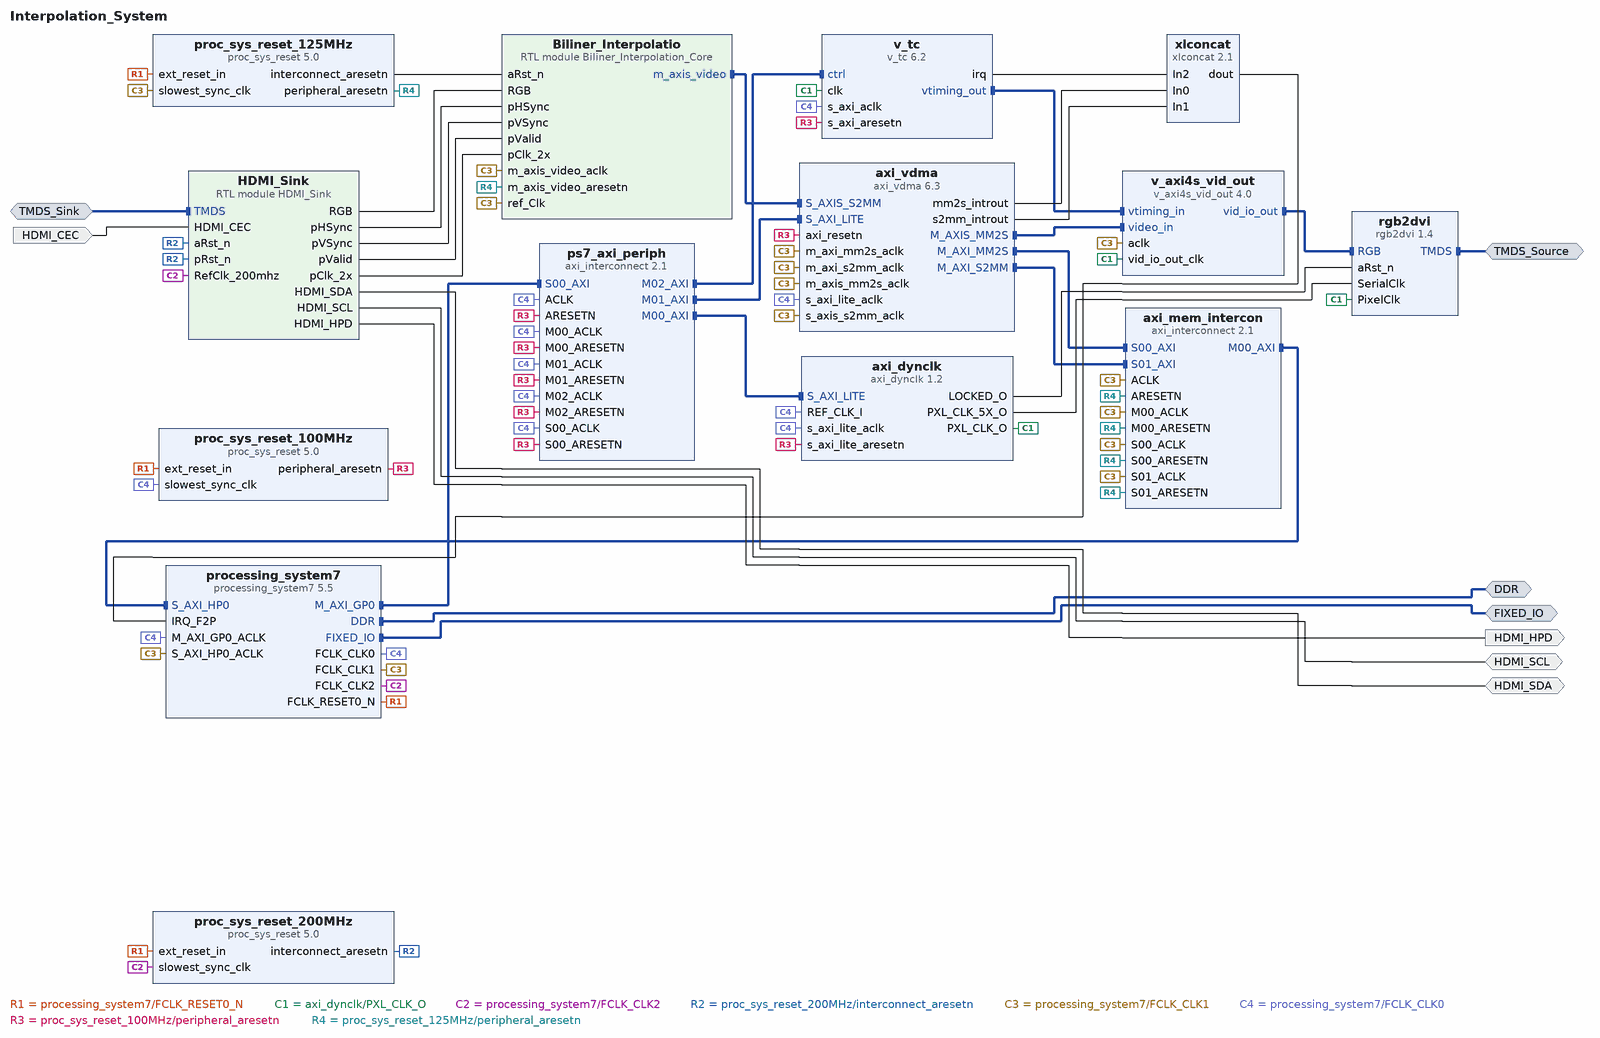
[diagram p0: block diagram of the top level]
# Vivado block design Interpolation_System, xc7z020clg400-1, Vivado 2019.2
create_bd_design Interpolation_System

create_bd_intf_port -mode Master -vlnv xilinx.com:interface:ddrx_rtl:1.0 DDR
create_bd_intf_port -mode Master -vlnv xilinx.com:display_processing_system7:fixedio_rtl:1.0 FIXED_IO
create_bd_intf_port -mode Master -vlnv digilentinc.com:interface:tmds_rtl:1.0 TMDS_Source
create_bd_intf_port -mode Slave -vlnv digilentinc.com:interface:tmds_rtl:1.0 TMDS_Sink
create_bd_port -dir IO HDMI_SDA
create_bd_port -dir IO HDMI_SCL
create_bd_port -dir O HDMI_HPD
create_bd_port -dir I HDMI_CEC

create_bd_cell -type ip -vlnv xilinx.com:ip:processing_system7:5.5 processing_system7
set_property -dict [list \
  CONFIG.PCW_APU_PERIPHERAL_FREQMHZ 650 \
  CONFIG.PCW_CRYSTAL_PERIPHERAL_FREQMHZ 50 \
  CONFIG.PCW_ENET0_ENET0_IO {MIO 16 .. 27} \
  CONFIG.PCW_ENET0_GRP_MDIO_ENABLE 1 \
  CONFIG.PCW_ENET0_GRP_MDIO_IO {MIO 52 .. 53} \
  CONFIG.PCW_ENET0_PERIPHERAL_ENABLE 1 \
  CONFIG.PCW_ENET0_RESET_ENABLE 1 \
  CONFIG.PCW_ENET0_RESET_IO {MIO 9} \
  CONFIG.PCW_ENET_RESET_ENABLE 1 \
  CONFIG.PCW_ENET_RESET_SELECT {Share reset pin} \
  CONFIG.PCW_EN_CLK1_PORT 1 \
  CONFIG.PCW_EN_CLK2_PORT 1 \
  CONFIG.PCW_FPGA0_PERIPHERAL_FREQMHZ 100 \
  CONFIG.PCW_FPGA1_PERIPHERAL_FREQMHZ 125 \
  CONFIG.PCW_FPGA2_PERIPHERAL_FREQMHZ 200 \
  CONFIG.PCW_FPGA_FCLK1_ENABLE 1 \
  CONFIG.PCW_FPGA_FCLK2_ENABLE 1 \
  CONFIG.PCW_GPIO_MIO_GPIO_ENABLE 1 \
  CONFIG.PCW_GPIO_MIO_GPIO_IO MIO \
  CONFIG.PCW_I2C_RESET_ENABLE 1 \
  CONFIG.PCW_IRQ_F2P_INTR 1 \
  CONFIG.PCW_PERIPHERAL_BOARD_PRESET None \
  CONFIG.PCW_PRESET_BANK1_VOLTAGE {LVCMOS 1.8V} \
  CONFIG.PCW_QSPI_GRP_FBCLK_ENABLE 1 \
  CONFIG.PCW_QSPI_GRP_FBCLK_IO {MIO 8} \
  CONFIG.PCW_QSPI_GRP_SINGLE_SS_ENABLE 1 \
  CONFIG.PCW_QSPI_GRP_SINGLE_SS_IO {MIO 1 .. 6} \
  CONFIG.PCW_QSPI_PERIPHERAL_ENABLE 1 \
  CONFIG.PCW_QSPI_QSPI_IO {MIO 1 .. 6} \
  CONFIG.PCW_SD0_PERIPHERAL_ENABLE 0 \
  CONFIG.PCW_SDIO_PERIPHERAL_FREQMHZ 50 \
  CONFIG.PCW_SINGLE_QSPI_DATA_MODE x4 \
  CONFIG.PCW_UART0_PERIPHERAL_ENABLE 1 \
  CONFIG.PCW_UART0_UART0_IO {MIO 14 .. 15} \
  CONFIG.PCW_UART1_PERIPHERAL_ENABLE 0 \
  CONFIG.PCW_UART_PERIPHERAL_FREQMHZ 100 \
  CONFIG.PCW_UIPARAM_DDR_BUS_WIDTH {16 Bit} \
  CONFIG.PCW_UIPARAM_DDR_FREQ_MHZ 525 \
  CONFIG.PCW_UIPARAM_DDR_PARTNO {MT41J256M16 RE-125} \
  CONFIG.PCW_USB0_PERIPHERAL_ENABLE 0 \
  CONFIG.PCW_USB0_RESET_ENABLE 1 \
  CONFIG.PCW_USB0_RESET_IO {MIO 46} \
  CONFIG.PCW_USB_RESET_ENABLE 1 \
  CONFIG.PCW_USE_FABRIC_INTERRUPT 1 \
  CONFIG.PCW_USE_S_AXI_HP0 1 \
] [get_bd_cells processing_system7]
# 494 more settings of processing_system7 are not shown: defaults, MIO pin electricals, DDR timing, and values the tool derives
create_bd_cell -type ip -vlnv xilinx.com:ip:axi_vdma:6.3 axi_vdma
set_property -dict [list \
  CONFIG.c_include_mm2s_dre 1 \
  CONFIG.c_include_s2mm_dre 1 \
  CONFIG.c_m_axi_s2mm_data_width 64 \
  CONFIG.c_m_axis_mm2s_tdata_width 24 \
  CONFIG.c_mm2s_genlock_mode 0 \
  CONFIG.c_mm2s_linebuffer_depth 2048 \
  CONFIG.c_mm2s_max_burst_length 128 \
  CONFIG.c_num_fstores 4 \
  CONFIG.c_s2mm_genlock_mode 1 \
  CONFIG.c_s2mm_linebuffer_depth 2048 \
  CONFIG.c_s2mm_max_burst_length 128 \
] [get_bd_cells axi_vdma]
create_bd_cell -type ip -vlnv xilinx.com:ip:proc_sys_reset:5.0 proc_sys_reset_100MHz
create_bd_cell -type ip -vlnv xilinx.com:ip:proc_sys_reset:5.0 proc_sys_reset_125MHz
create_bd_cell -type ip -vlnv xilinx.com:ip:v_tc:6.2 v_tc
set_property -dict {CONFIG.enable_detection false} [get_bd_cells v_tc]
create_bd_cell -type ip -vlnv xilinx.com:ip:v_axi4s_vid_out:4.0 v_axi4s_vid_out
set_property -dict {CONFIG.C_ADDR_WIDTH 12 CONFIG.C_HAS_ASYNC_CLK 1 CONFIG.C_VTG_MASTER_SLAVE 1} [get_bd_cells v_axi4s_vid_out]
create_bd_cell -type ip -vlnv xilinx.com:ip:xlconcat:2.1 xlconcat
set_property -dict {CONFIG.NUM_PORTS 3} [get_bd_cells xlconcat]
create_bd_cell -type ip -vlnv digilentinc.com:ip:axi_dynclk:1.2 axi_dynclk
create_bd_cell -type ip -vlnv digilentinc.com:ip:rgb2dvi:1.4 rgb2dvi
set_property -dict {CONFIG.kGenerateSerialClk false CONFIG.kRstActiveHigh false} [get_bd_cells rgb2dvi]
create_bd_cell -type ip -vlnv xilinx.com:ip:proc_sys_reset:5.0 proc_sys_reset_200MHz
create_bd_cell -type ip -vlnv xilinx.com:ip:axi_interconnect:2.1 ps7_axi_periph
set_property -dict {CONFIG.NUM_MI 3} [get_bd_cells ps7_axi_periph]
create_bd_cell -type ip -vlnv xilinx.com:ip:axi_interconnect:2.1 axi_mem_intercon
set_property -dict {CONFIG.NUM_MI 1 CONFIG.NUM_SI 2} [get_bd_cells axi_mem_intercon]
create_bd_cell -type module -reference HDMI_Sink HDMI_Sink
create_bd_cell -type module -reference Biliner_Interpolation_Core Biliner_Interpolatio

# ---- connections ----

connect_bd_intf_net [get_bd_intf_pins axi_vdma/M_AXIS_MM2S] [get_bd_intf_pins v_axi4s_vid_out/video_in]
connect_bd_intf_net [get_bd_intf_pins ps7_axi_periph/M01_AXI] [get_bd_intf_pins axi_vdma/S_AXI_LITE]
connect_bd_intf_net [get_bd_intf_pins rgb2dvi/RGB] [get_bd_intf_pins v_axi4s_vid_out/vid_io_out]
connect_bd_intf_net [get_bd_intf_pins processing_system7/M_AXI_GP0] [get_bd_intf_pins ps7_axi_periph/S00_AXI]
connect_bd_intf_net [get_bd_intf_pins ps7_axi_periph/M00_AXI] [get_bd_intf_pins axi_dynclk/S_AXI_LITE]
connect_bd_intf_net [get_bd_intf_ports DDR] [get_bd_intf_pins processing_system7/DDR]
connect_bd_intf_net [get_bd_intf_pins v_tc/vtiming_out] [get_bd_intf_pins v_axi4s_vid_out/vtiming_in]
connect_bd_intf_net -intf_net Biliner_Interpolatio_0_m_axis_video [get_bd_intf_pins Biliner_Interpolatio/m_axis_video] [get_bd_intf_pins axi_vdma/S_AXIS_S2MM]
connect_bd_intf_net [get_bd_intf_ports FIXED_IO] [get_bd_intf_pins processing_system7/FIXED_IO]
connect_bd_intf_net [get_bd_intf_ports TMDS_Source] [get_bd_intf_pins rgb2dvi/TMDS]
connect_bd_intf_net -intf_net TMDS_0_1 [get_bd_intf_ports TMDS_Sink] [get_bd_intf_pins HDMI_Sink/TMDS]
connect_bd_intf_net [get_bd_intf_pins axi_vdma/M_AXI_MM2S] [get_bd_intf_pins axi_mem_intercon/S00_AXI]
connect_bd_intf_net [get_bd_intf_pins axi_mem_intercon/M00_AXI] [get_bd_intf_pins processing_system7/S_AXI_HP0]
connect_bd_intf_net [get_bd_intf_pins ps7_axi_periph/M02_AXI] [get_bd_intf_pins v_tc/ctrl]
connect_bd_intf_net [get_bd_intf_pins axi_vdma/M_AXI_S2MM] [get_bd_intf_pins axi_mem_intercon/S01_AXI]
connect_bd_net -net processing_system7_0_FCLK_RESET0_N [get_bd_pins processing_system7/FCLK_RESET0_N] \
  [get_bd_pins proc_sys_reset_100MHz/ext_reset_in] [get_bd_pins proc_sys_reset_125MHz/ext_reset_in] \
  [get_bd_pins proc_sys_reset_200MHz/ext_reset_in]
connect_bd_net [get_bd_pins axi_vdma/mm2s_introut] [get_bd_pins xlconcat/In0]
connect_bd_net [get_bd_pins axi_vdma/s2mm_introut] [get_bd_pins xlconcat/In1]
connect_bd_net [get_bd_pins v_tc/irq] [get_bd_pins xlconcat/In2]
connect_bd_net [get_bd_pins axi_dynclk/PXL_CLK_O] [get_bd_pins v_tc/clk] [get_bd_pins v_axi4s_vid_out/vid_io_out_clk] [get_bd_pins rgb2dvi/PixelClk]
connect_bd_net [get_bd_pins axi_dynclk/LOCKED_O] [get_bd_pins rgb2dvi/aRst_n]
connect_bd_net [get_bd_pins axi_dynclk/PXL_CLK_5X_O] [get_bd_pins rgb2dvi/SerialClk]
connect_bd_net [get_bd_pins xlconcat/dout] [get_bd_pins processing_system7/IRQ_F2P]
connect_bd_net [get_bd_pins processing_system7/FCLK_CLK2] [get_bd_pins proc_sys_reset_200MHz/slowest_sync_clk] [get_bd_pins HDMI_Sink/RefClk_200mhz]
connect_bd_net [get_bd_ports HDMI_SDA] [get_bd_pins HDMI_Sink/HDMI_SDA]
connect_bd_net [get_bd_ports HDMI_SCL] [get_bd_pins HDMI_Sink/HDMI_SCL]
connect_bd_net [get_bd_pins HDMI_Sink/HDMI_HPD] [get_bd_ports HDMI_HPD]
connect_bd_net [get_bd_pins HDMI_Sink/RGB] [get_bd_pins Biliner_Interpolatio/RGB]
connect_bd_net [get_bd_pins HDMI_Sink/pHSync] [get_bd_pins Biliner_Interpolatio/pHSync]
connect_bd_net [get_bd_pins HDMI_Sink/pVSync] [get_bd_pins Biliner_Interpolatio/pVSync]
connect_bd_net [get_bd_pins HDMI_Sink/pValid] [get_bd_pins Biliner_Interpolatio/pValid]
connect_bd_net [get_bd_pins HDMI_Sink/pClk_2x] [get_bd_pins Biliner_Interpolatio/pClk_2x]
connect_bd_net [get_bd_pins proc_sys_reset_200MHz/interconnect_aresetn] [get_bd_pins HDMI_Sink/aRst_n] [get_bd_pins HDMI_Sink/pRst_n]
connect_bd_net -net HDMI_CEC_0_1 [get_bd_ports HDMI_CEC] [get_bd_pins HDMI_Sink/HDMI_CEC]
connect_bd_net [get_bd_pins processing_system7/FCLK_CLK1] \
  [get_bd_pins proc_sys_reset_125MHz/slowest_sync_clk] [get_bd_pins axi_vdma/m_axi_mm2s_aclk] \
  [get_bd_pins axi_vdma/m_axis_mm2s_aclk] [get_bd_pins axi_vdma/m_axi_s2mm_aclk] [get_bd_pins axi_vdma/s_axis_s2mm_aclk] \
  [get_bd_pins processing_system7/S_AXI_HP0_ACLK] [get_bd_pins v_axi4s_vid_out/aclk] [get_bd_pins axi_mem_intercon/ACLK] \
  [get_bd_pins axi_mem_intercon/S00_ACLK] [get_bd_pins axi_mem_intercon/M00_ACLK] [get_bd_pins axi_mem_intercon/S01_ACLK] \
  [get_bd_pins Biliner_Interpolatio/ref_Clk] [get_bd_pins Biliner_Interpolatio/m_axis_video_aclk]
connect_bd_net [get_bd_pins processing_system7/FCLK_CLK0] \
  [get_bd_pins proc_sys_reset_100MHz/slowest_sync_clk] [get_bd_pins axi_dynclk/REF_CLK_I] [get_bd_pins v_tc/s_axi_aclk] \
  [get_bd_pins axi_vdma/s_axi_lite_aclk] [get_bd_pins processing_system7/M_AXI_GP0_ACLK] \
  [get_bd_pins axi_dynclk/s_axi_lite_aclk] [get_bd_pins ps7_axi_periph/ACLK] [get_bd_pins ps7_axi_periph/S00_ACLK] \
  [get_bd_pins ps7_axi_periph/M00_ACLK] [get_bd_pins ps7_axi_periph/M01_ACLK] [get_bd_pins ps7_axi_periph/M02_ACLK]
connect_bd_net [get_bd_pins proc_sys_reset_100MHz/peripheral_aresetn] \
  [get_bd_pins ps7_axi_periph/S00_ARESETN] [get_bd_pins axi_dynclk/s_axi_lite_aresetn] \
  [get_bd_pins ps7_axi_periph/M00_ARESETN] [get_bd_pins ps7_axi_periph/ARESETN] [get_bd_pins axi_vdma/axi_resetn] \
  [get_bd_pins ps7_axi_periph/M01_ARESETN] [get_bd_pins v_tc/s_axi_aresetn] [get_bd_pins ps7_axi_periph/M02_ARESETN]
connect_bd_net [get_bd_pins proc_sys_reset_125MHz/peripheral_aresetn] \
  [get_bd_pins axi_mem_intercon/S00_ARESETN] [get_bd_pins axi_mem_intercon/M00_ARESETN] \
  [get_bd_pins axi_mem_intercon/ARESETN] [get_bd_pins axi_mem_intercon/S01_ARESETN] \
  [get_bd_pins Biliner_Interpolatio/m_axis_video_aresetn]
connect_bd_net [get_bd_pins proc_sys_reset_125MHz/interconnect_aresetn] [get_bd_pins Biliner_Interpolatio/aRst_n]

# ---- address map ----
assign_bd_address -offset 0x00000000 -range 512M -target_address_space [get_bd_addr_spaces axi_vdma/Data_MM2S] [get_bd_addr_segs processing_system7/S_AXI_HP0/HP0_DDR_LOWOCM]
assign_bd_address -offset 0x00000000 -range 512M -target_address_space [get_bd_addr_spaces axi_vdma/Data_S2MM] [get_bd_addr_segs processing_system7/S_AXI_HP0/HP0_DDR_LOWOCM]
assign_bd_address -offset 0x43000000 -range 64K -target_address_space [get_bd_addr_spaces processing_system7/Data] [get_bd_addr_segs axi_vdma/S_AXI_LITE/Reg]
assign_bd_address -offset 0x43C00000 -range 64K -target_address_space [get_bd_addr_spaces processing_system7/Data] [get_bd_addr_segs v_tc/ctrl/Reg]
assign_bd_address -offset 0x43C10000 -range 64K -target_address_space [get_bd_addr_spaces processing_system7/Data] [get_bd_addr_segs axi_dynclk/S_AXI_LITE/S_AXI_LITE_reg]

validate_bd_design
save_bd_design
